# Altium schematic sheet reciever_v1.SchDoc
size A3; SheetNumber: 1; SheetTotal: 1
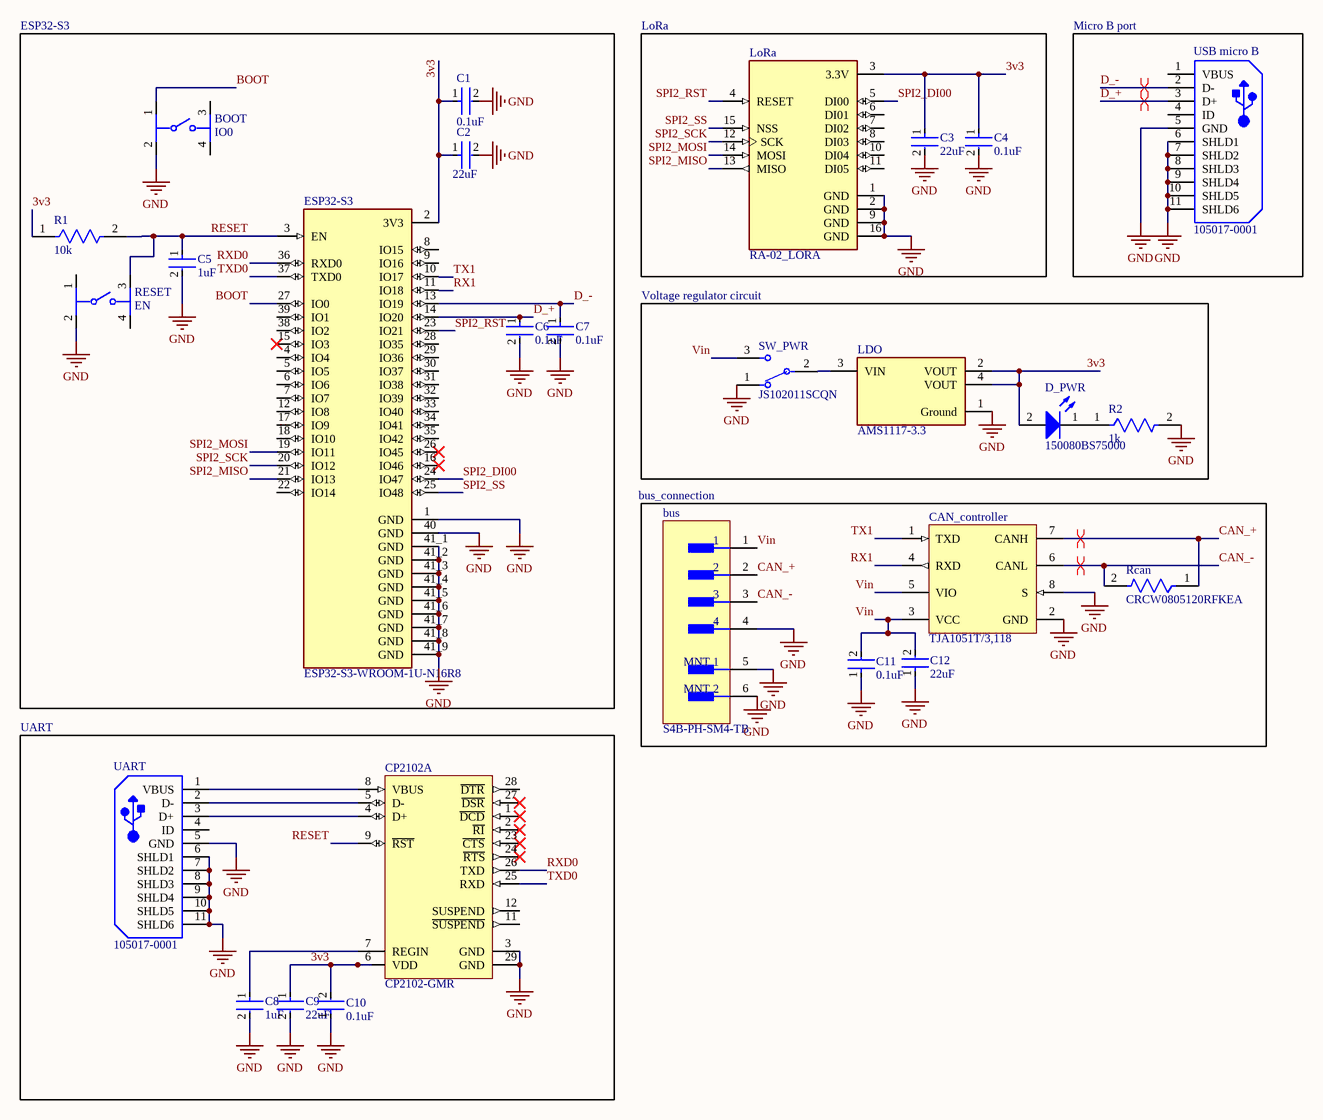
[diagram p0: reciever_v1.SchDoc]

## Parts
BOOT  IO0  [FP-8-1437565-1-MFG]
bus  S4B-PH-SM4-TB  [FP-S4B-PH-SM4-TB-MFG]
C1  0.1uF  [FP-0805-L_2_01_0_2-W_1_25-IPC_C]
C2  22uF  [FP-0805-L_2_01_0_2-W_1_25-IPC_B]
C3  22uF  [FP-0805-L_2_01_0_2-W_1_25-IPC_B]
C4  0.1uF  [FP-0805-L_2_01_0_2-W_1_25-IPC_C]
C5  1uF  [FP-0805-L_2_01_0_2-W_1_25-IPC_B]
C6  0.1uF  [FP-0805-L_2_01_0_2-W_1_25-IPC_C]
C7  0.1uF  [FP-0805-L_2_01_0_2-W_1_25-IPC_C]
C8  1uF  [FP-0805-L_2_01_0_2-W_1_25-IPC_B]
C9  22uF  [FP-0805-L_2_01_0_2-W_1_25-IPC_B]
C10  0.1uF  [FP-0805-L_2_01_0_2-W_1_25-IPC_C]
C11  0.1uF  [FP-0805-L_2_01_0_2-W_1_25-IPC_C]
C12  22uF  [FP-0805-L_2_01_0_2-W_1_25-IPC_B]
CAN_controller  TJA1051T/3,118  [NXP-SOIC-8_L]
CP2102  CP2102-GMR  [SLAB-QFN-28-3125x3125TP_M]  (part A of 2)
D_PWR  150080BS75000  [WL-SMCW_0805_150080xx75000]
ESP32-S3  ESP32-S3-WROOM-1U-N16R8  [XCVR_ESP32-S3-WROOM-1U-N16R8]
LDO  AMS1117-3.3  [FP-AMS1117-IPC_C]
LoRa  RA-02_LORA  [MODULE_RA-02_LORA]
R1  10k  [FP-CRCW0805-e3-IPC_A]
R2  1k  [FP-CRCW0805-e3-MFG]
Rcan  CRCW0805120RFKEA  [FP-CRCW0805-e3-IPC_C]
RESET  EN  [FP-8-1437565-1-MFG]
SW_PWR  JS102011SCQN  [FP-JS102011SCQN-MFG]
UART  105017-0001  [USB-MICRO-B_V]
USB_micro_B  105017-0001  [USB-MICRO-B_V]

## Blocks framed on the sheet
ESP32-S3: BOOT C1 C2 C5-C7 ESP32-S3 R1 RESET
LoRa: C3 C4 LoRa
Micro B port: USB_micro_B
Voltage regulator circuit: D_PWR LDO R2 SW_PWR
bus_connection: bus C11 C12 CAN_controller Rcan
UART: C8-C10 CP2102 UART

## Nets
GND: BOOT.2 bus.4 bus.5(MNT_1) bus.6(MNT_2) C1.2 C2.2 C3.2 C4.2 C5.2 C6.2 C7.2 C8.2 C9.2 C10.1 C11.1 C12.1 CAN_controller.2(GND) CAN_controller.8(S) CP2102.3(GND) CP2102.29(GND) ESP32-S3.1(GND) ESP32-S3.40(GND) ESP32-S3.41_1(GND) ESP32-S3.41_2(GND) ESP32-S3.41_3(GND) ESP32-S3.41_4(GND) ESP32-S3.41_5(GND) ESP32-S3.41_6(GND) ESP32-S3.41_7(GND) ESP32-S3.41_8(GND) ESP32-S3.41_9(GND) LDO.1(Ground) LoRa.1(GND) LoRa.2(GND) LoRa.9(GND) LoRa.16(GND) R2.2 RESET.2 SW_PWR.1 UART.5(GND) UART.6(SHLD1) UART.7(SHLD2) UART.8(SHLD3) UART.9(SHLD4) UART.10(SHLD5) UART.11(SHLD6) USB_micro_B.5(GND) USB_micro_B.6(SHLD1) USB_micro_B.7(SHLD2) USB_micro_B.8(SHLD3) USB_micro_B.9(SHLD4) USB_micro_B.10(SHLD5) USB_micro_B.11(SHLD6)
3v3: C1.1 C2.1 C3.1 C4.1 C9.1 C10.2 CP2102.6(VDD) D_PWR.2(A) ESP32-S3.2(3V3) LDO.2(VOUT) LDO.4(VOUT) LoRa.3(3.3V) R1.1
BOOT: BOOT.1 ESP32-S3.27(IO0)
CAN_+: bus.2 CAN_controller.7(CANH) Rcan.1
CAN_-: bus.3 CAN_controller.6(CANL) Rcan.2
D_+: C6.1 ESP32-S3.14(IO20) USB_micro_B.3(D+)
D_-: C7.1 ESP32-S3.13(IO19) USB_micro_B.2(D-)
RESET: C5.1 CP2102.9(~{RST}) ESP32-S3.3(EN) R1.2 RESET.3
RX1: CAN_controller.4(RXD) ESP32-S3.11(IO18)
RXD0: CP2102.26(TXD) ESP32-S3.36(RXD0)
SPI2_DI00: ESP32-S3.24(IO47) LoRa.5(DI00)
SPI2_MISO: ESP32-S3.21(IO13) LoRa.13(MISO)
SPI2_MOSI: ESP32-S3.19(IO11) LoRa.14(MOSI)
SPI2_RST: ESP32-S3.23(IO21) LoRa.4(RESET)
SPI2_SCK: ESP32-S3.20(IO12) LoRa.12(SCK)
SPI2_SS: ESP32-S3.25(IO48) LoRa.15(NSS)
TX1: CAN_controller.1(TXD) ESP32-S3.10(IO17)
TXD0: CP2102.25(RXD) ESP32-S3.37(TXD0)
Vin: bus.1 C11.2 C12.2 CAN_controller.3(VCC) CAN_controller.5(VIO) SW_PWR.3
NetC8_1: C8.1 CP2102.7(REGIN)
NetCP2102_4: CP2102.4(D+) UART.3(D+)
NetCP2102_5: CP2102.5(D-) UART.2(D-)
NetCP2102_8: CP2102.8(VBUS) UART.1(VBUS)
NetD_PWR_1: D_PWR.1(K) R2.1
NetLDO_3: LDO.3(VIN) SW_PWR.2(C)

Not connected (* = marked no-connect by the designer): BOOT 3 4; CP2102 1(~{DCD})* 2(~{RI})* 11(~{SUSPEND}) 12(SUSPEND) 23(~{CTS})* 24(~{RTS})* 27(~{DSR})* 28(~{DTR}); ESP32-S3 4(IO4) 5(IO5) 6(IO6) 7(IO7) 8(IO15) 9(IO16) 12(IO8) 15(IO3)* 16(IO46)* 17(IO9) 18(IO10) 22(IO14) 26(IO45)* 28(IO35) 29(IO36) 30(IO37) 31(IO38) 32(IO39) 33(IO40) 34(IO41) 35(IO42) 38(IO2) 39(IO1); LoRa 6(DI01) 7(DI02) 8(DI03) 10(DI04) 11(DI05); RESET 1 4; UART 4(ID); USB_micro_B 1(VBUS) 4(ID)

## Layout directives
differential pair: CAN_+, CAN_-, D_+, D_-

## Library data of the parts
BOOT RESET = CMP-03407-000016-1: SWITCH TACTILE SPST-NO 0.02A 15V; Actuator Length: 0.4mm; Actuator Material: Brass; Contact Current Rating: 20mA; Switch Travel: 0.25mm; Switch Function: Off-Mom; Electrical Life: 500000Cycles; Contact Resistance: 100mR; Illumination Type: Non-Illuminated; Operating Force: 1.57N; Actuator Type: Standard; Throw Configuration: SPST; Radiation Hardening: No; Orientation: Straight; Packaging: Tape and Reel; Type: Switch; Max Operating Temperature: 85°C; Contact Material: Copper Alloy; Package Quantity: 4000; Max Voltage Rating (DC): 15V; Contact Plating: Silver; Mechanical Life: 500000Cycles; Case/Package: SMD/SMT; RoHS Compliant: Yes; Series: FSMCT; Mount: Surface Mount; Max Current Rating: 20mA; ELV: Compliant; Voltage Rating (DC): 15V; Termination: Gull Wing; Min Operating Temperature: -35°C
bus = CMP-00504-08293667-1: S4B-PH-SM4-TB Header S4B-PH-SM4-TB, 2.00mm, 4-contacts, side entry, SMT, /1000/reel; Max Voltage Rating (DC): 100V; Gender: Male; Number of Contacts: 4; Pitch: 2mm; Max Current Rating: 2A; Contact Resistance: 20mΩ; Termination: Solder; Contact Plating: Copper, Tin; Max Voltage Rating (AC): 100V; Number of Pins: 4; Length: 11.9mm; Housing Color: Beige; RoHS: Non-Compliant; Voltage Rating: 100V; Depth: 7.6mm; Height: 5.5mm; Current Rating: 2A; Max Operating Temperature: 85°C; Min Operating Temperature: -25°C; Number of Rows: 1; Housing Material: Polyamide; Contact Material: Copper, Tin; Packaging: Tape and Reel
C1 C4 C6 C7 C10 C11 = CMP-2000-05016-2: General Purpose Ceramic Capacitor, 0805, 100nF, 10%, X7R, 0.15, 50V; Dissipation Factor: 2.5%; Insulation Resistance: 100GR; Voltage Rating (DC): 50V; Package Quantity: 4000; Tolerance: 10%; Voltage Rating: 50V; Dielectric: X7R; Case/Package: 0805; Lead Free: Lead Free; Dielectric Material: Ceramic; Thickness: 0.037inch; Weight: 0.001411oz; Max Operating Temperature: 125°C; REACH SVHC: No SVHC; Mount: Surface Mount; RoHS Compliant: Yes; Depth: 1.25mm; Height: 0.5mm; Case Code (Metric): 2012; Length: 2mm; Termination: Standard; Case Code (Imperial): 0805; Number of Pins: 2; Voltage: 50V; Radiation Hardening: No; Min Operating Temperature: -55°C; Capacitance: 100nF; Width: 1.2mm; Series: MLCC X7R; Packaging: Cut Tape
C2 C3 C9 C12 = CMP-1036-04939-3: General Purpose Ceramic Capacitor, 0805, 22uF, 20%, X5R, 15%, 6.3V; Dissipation Factor: 12.5%; Insulation Resistance: 10GR; Dielectric Material: Ceramic; Tolerance: 20%; Max Operating Temperature: 85°C; Min Operating Temperature: -55°C; Package Quantity: 1; Termination: SMD/SMT; Voltage Rating: 6.3V; Voltage: 6.3V; Width: 0.049inch; Mount: Surface Mount; Thickness: 0.055inch; RoHS Compliant: Yes; Lead Free: Lead Free; Packaging: Tape and Reel; Capacitance: 22uF; Depth: 1.25mm; Radiation Hardening: No; Voltage Rating (DC): 6.3V; Number of Pins: 2; Dielectric: X5R; Case/Package: 0805; Length: 2.01mm; Case Code (Metric): 2012; REACH SVHC: No SVHC; Case Code (Imperial): 0805; Height: 1.4mm
C5 C8 = CMP-2007-04599-2: General Purpose Ceramic Capacitor, 0805, 1uF, 10%, X7R, 15%, 25V; Temperature Coefficient: 30ppm/°C; Packaging: Tape and Reel; Min Operating Temperature: -55°C; Contact Plating: Tin; Tolerance: 10%; Radiation Hardening: No; Height: 1.4mm; Case Code (Metric): 2012; Mount: Surface Mount; Lead Free: Lead Free; REACH SVHC: No SVHC; Features: Soft Termination; Voltage Rating (DC): 25V; Length: 2.01mm; Capacitance: 1uF; Thickness: 0.055inch; Series: FLEXITERM®; Case/Package: 0805; Depth: 1.25mm; Number of Pins: 2; Max Operating Temperature: 125°C; Package Quantity: 1; Dielectric: X7R; Construction: Flat; Width: 1.25mm; Case Code (Imperial): 0805; Voltage: 25V; RoHS Compliant: Yes; Termination: SMD/SMT; Voltage Rating: 25V
CAN_controller = CMP-2000-07245-1: High-Speed CAN Transceiver, 3 to 5 V, 8-Pin SOIC (SOT96-1), RoHS, Tape and Reel; Manufacturer: NXP; Power Down Mode: Normal/Silent; Rad Hardened: No; Number of Transceivers: 1; Supply Current: 70mA; Operating Supply Voltage (Max): 5.5V; Operating Supply Voltage (Typ): 5V; Operating Supply Voltage (Min): 4.5V; Standard Supported: ISO11898-2; Data Rate: 1Mbps; DELETED: Compliant; Operating Temperature (Min): -40C; Datasheet Version: Rev. 7, 01/2015; Pin Count: 8; Operating Temperature (Max): 125C; Package Description: 8-Pin Small Outline Integrated Circuit, Body 4.9 x 3.9 mm, Pitch 1.27 mm; Category: Transceiver; Packaging: TapeandReel; Mounting: SurfaceMount; Package Reference: SOT96-1; Operating Temperature Classification: Automotive; Mounting Technology: SurfaceMount; Package Type: SO; Manufacturer URL: http://www.nxp.com/; Datasheet URL: http://www.nxp.com/documents/data_sheet/TJA1051.pdf
CP2102 = CMP-2000-04924-1: Single-Chip USB to URAT Bridge, 3.3 V, -40 to 85 degC, 28-Pin QFN, RoHS, Tape and Reel; Manufacturer: Silicon Labs; Interface Circuit Standard 1: RS-232; Transmitter and Receiver FIFO Counter: No; Supply Current: 26mA; Operating Supply Voltage (Min): 3V; Operating Supply Voltage (Typ): 3.3V; Data Rate: 1000kbps; Operating Supply Voltage (Max): 3.6V; Number of Channels: 1; Package URL: http://www.silabs.com/Support%20Documents/TechnicalDocs/C8051T61x.pdf; Operating Temperature (Max): 85C; Datasheet URL: http://www.mouser.com/ds/2/368/CP2102-9-247052.pdf; Operating Temperature Classification: Industrial; Operating Temperature (Min): -40C; Package Description: 28-Pin Quad-Flat No-Leads Package, Body 5 x 5 mm, Pitch 0.5 mm; Manufacturer URL: http://www.silabs.com/; Rad Hardened: No; Package Reference: QFN-28; Pin Count: 28; Packaging: TapeandReel; Mounting: SurfaceMount; Package Type: QFNEP; Datasheet Version: Rev. 1.6, 12/2013
D_PWR = CMP-1426-00008-7: Led, Blue, 470 Nm, 3.2 V, 30 Ma, 145 Mcd Rohs Compliant: Yes; Dominant Wavelength: 470nm; Max Junction Temperature (Tj): 95°C; Power Dissipation: 105mW; Peak Wavelength: 465nm; Max Reverse Voltage (DC): 5V; Forward Current: 100mA; Test Current: 20mA; Luminous Intensity: 145mcd; Lens Style: Clear, Rectangular; Viewing Angle: 140°; Forward Voltage: 3.2V; Color: Blue; Height: 700µm; Case Code (Imperial): 0805; Width: 1.25mm; REACH SVHC: Unknown; Case/Package: 0805; Lead Free: Lead Free; Mount: Surface Mount; Packaging: Tape and Reel; RoHS: Compliant; Reverse Voltage: 5V; Min Operating Temperature: -40°C; Case Code (Metric): 2012; Wavelength: 470nm; Max Operating Temperature: 85°C; Length: 2mm
ESP32-S3 = ESP32-S3-WROOM-1U-N16R8: Bluetooth, WiFi 802.11b/g/n, Bluetooth v5.0 Transceiver Module 2.4GHz Antenna Not Included, U.FL Surface Mount; MF: Espressif Systems; Package: None; Price: None; Value: *; SnapEDA_Link: https://www.snapeda.com/parts/ESP32-S3-WROOM-1U-N16R8/Espressif+Systems/view-part/?ref=snap; MP: ESP32-S3-WROOM-1U-N16R8; Availability: Unavailable; Check_prices: https://www.snapeda.com/parts/ESP32-S3-WROOM-1U-N16R8/Espressif+Systems/view-part/?ref=eda
LDO = CMP-209535-000001-1: LDO Voltage Regulators 1A, 3.3V; Manufacturer: Advanced Monolithic Systems; Dropout Voltage: 1.1V; Output Type: Fixed; Nominal Supply Current: 5mA; Max Power Dissipation: 1.2W; Max Supply Voltage: 15V; Number Of Outputs: 1; Standoff Height: 0.64mm; Max Junction Temp: +125°C; Height: 1.8mm; Package: AMS1117; Device Class L2: Power Management ICs; ComponentLink2Description: Datasheet; ComponentLink2URL: http://www.advanced-monolithic.com/pdf/ds1117.pdf; Category: IC; RoHS: TRUE; Automotive: No; Device Class L1: Integrated Circuits (ICs); Output Current: 1A; Device Class L3: Voltage Regulators - Linear; Temperature: -40°C to +125°C; Output Voltage: 3.3V; Manufacturer Part Number: AMS1117-3.3; Temperature Range Low: -40°C; Octopart: https://octopart.com/ams1117-3.3-advanced+monolithic+systems-25899300; Lead Free: Yes; Ipc Land Pattern Name: SOT229P700X180-4; Temperature Range High: +125°C
LoRa = RA-02_LORA: Ra-02 LoRa RF M5Stack Platform Evaluation Expansion Board; Price: None; Availability: Unavailable; MP: RA-02_LORA; Value: *; Package: None
R1 = CMP-2001-04908-2: RES Thick Film, 10kΩ, 1%, 0.125W, 100ppm/°C, 0805; Resistance: 10kR; Voltage Rating (DC): 150V; Power Rating: 125mW; Weight: 0.000194oz; Package Quantity: 5000; Military Standard: Not; Max Operating Temperature: 155°C; Temperature Coefficient: 100ppm/°C; Contact Plating: Tin; Width: 1.25mm; Height: 0.45mm; Radiation Hardening: No; Tolerance: 1%; Min Operating Temperature: -55°C; Voltage Rating: 150V; Length: 2mm; Depth: 1.25mm; Termination: SMD/SMT; Packaging: Tape and Reel; Case/Package: 0805; Case Code (Metric): 2012; Lead Free: Lead Free; Case Code (Imperial): 0805; Composition: Thick Film
R2 = CMP-2001-03607-2: RES Thick Film, 1.2kΩ, 1%, 0.125W, 100ppm/°C, 0805; Max Power Dissipation: 125mW; Voltage Rating (DC): 150V; Resistance: 1.2kR; Military Standard: Not; Termination: SMD/SMT; Package Quantity: 10; Min Operating Temperature: -55°C; Weight: 0.000194oz; Width: 0.049inch; Voltage Rating: 150V; Temperature Coefficient: 100ppm/°C; Case Code (Imperial): 0805; Packaging: Tape and Reel; Composition: Thick Film; Lead Free: Lead Free; Number of Terminations: 2; Depth: 1.25mm; Power Rating: 125mW; Tolerance: 1%; Radiation Hardening: No; Length: 2mm; Case Code (Metric): 2012; Max Operating Temperature: 155°C; Height: 0.45mm; Features: Automotive AEC-Q200; Contact Plating: Tin; Case/Package: 0805
Rcan = CMP-02407-007854-1: RES Thick Film, 120Ω, 1%, 0.125W, 100ppm/°C, 0805; Resistance: 120R; Voltage Rating (DC): 150V; Max Power Dissipation: 125mW; Height: 0.45mm; Min Operating Temperature: -55°C; Packaging: Tape and Reel; Package Quantity: 10; Width: 1.25mm; Weight: 0.000194oz; Termination: SMD/SMT; Mount: Surface Mount; Tolerance: 1%; Military Standard: Not; Max Operating Temperature: 155°C; Lead Free: Lead Free; Number of Terminations: 2; Radiation Hardening: No; Temperature Coefficient: 100ppm/°C; Length: 2mm; Case/Package: 0805; Voltage Rating: 150V; Case Code (Metric): 2012; Case Code (Imperial): 0805; Features: Automotive AEC-Q200; Composition: Thick Film; Contact Plating: Tin; Power Rating: 125mW; Depth: 1.25mm
SW_PWR = CMP-10038-000023-1: SWITCH SLIDE SPDT 300MA 6V; Electrical Life: 5000Cycles; Actuator Type: Standard; Contact Resistance: 70mR; Actuator Material: Nylon; Max Voltage Rating (DC): 30V; Actuator Length: 2mm; Switch Function: On-On; Actuator Color: Black; Radiation Hardening: No; Throw Configuration: SPDT; Depth: 7.5mm; Case/Package: SMD/SMT; Package Quantity: 4000; Min Operating Temperature: -40°C; Length: 8.5mm; Current Rating: 300mA; Mount: Surface Mount; Voltage Rating (DC): 6V; RoHS Compliant: Yes; Orientation: Straight; Housing Material: Nylon; Contact Plating: Silver; Max Operating Temperature: 85°C; Packaging: Tape and Reel; Switch Travel: 2mm; Max Current Rating: 300mA; Contact Material: Copper Alloy; Series: JS; Termination: Gull Wing
UART USB_micro_B = CMP-2000-05827-1: Micro-USB B Receptacle, Right Angle, Bottom Mount, Surface Mount, with Solder Tabs, -30 to 85 degC, 5-Pin USB, RoHS, Tape and Reel; Manufacturer: Molex; Featured Product: Micro-USBConnectorsUSBConnectors; Other Names: WM1399DKR; Package Version: Rev. F, 12/2012; Number of Contacts: 5; Connector Type: USB-microB; Catalog Drawings: 1050170001; 3D Model: 105017-0001.stp; Mating Products: WM17145-ND-CABLEMICROUSBBTOSTDA1.0MWM17147-ND-CABLEMICROUSBBTOSTDA2.0MWM17146-ND-CABLEMICROUSBBTOSTDA1.5M; PCN Assembly/Origin: ResinSupplier21/Oct/2015; Voltage - Max: 30V; Online Catalog: Molex-MicroUSB; Manufacturer URL: http://www.molex.com/; Package Description: 5-Leads USB, Micro B, Body 7.5 x 5 mm, Pitch 0.65 mm; Datasheet URL: http://www.molex.com/elqNow/elqRedir.htm?ref=http://www.molex.com/webdocs/datasheets/pdf/en-us/1050170001_IO_CONNECTORS.pdf; Ingress Protection: -; Datasheet Version: 03/2016; Mounting Type: BoardCutout,SurfaceMount,RightAngle; Circuits: 5; Standard Package: 1; Package Reference: MICRO-B; Package URL: http://www.molex.com/pdm_docs/sd/1050170001_sd.pdf; Category: Connectors,Interconnects; Series: -; RoHS Information: 1050170001CertofCompliance; Features: Shielded,SolderRetention; Family: USB,DVI,HDMIConnectors; Specifications: -; Gender: Receptacle; Packaging: Digi-Reel®; Mounting Technology: SurfaceMount